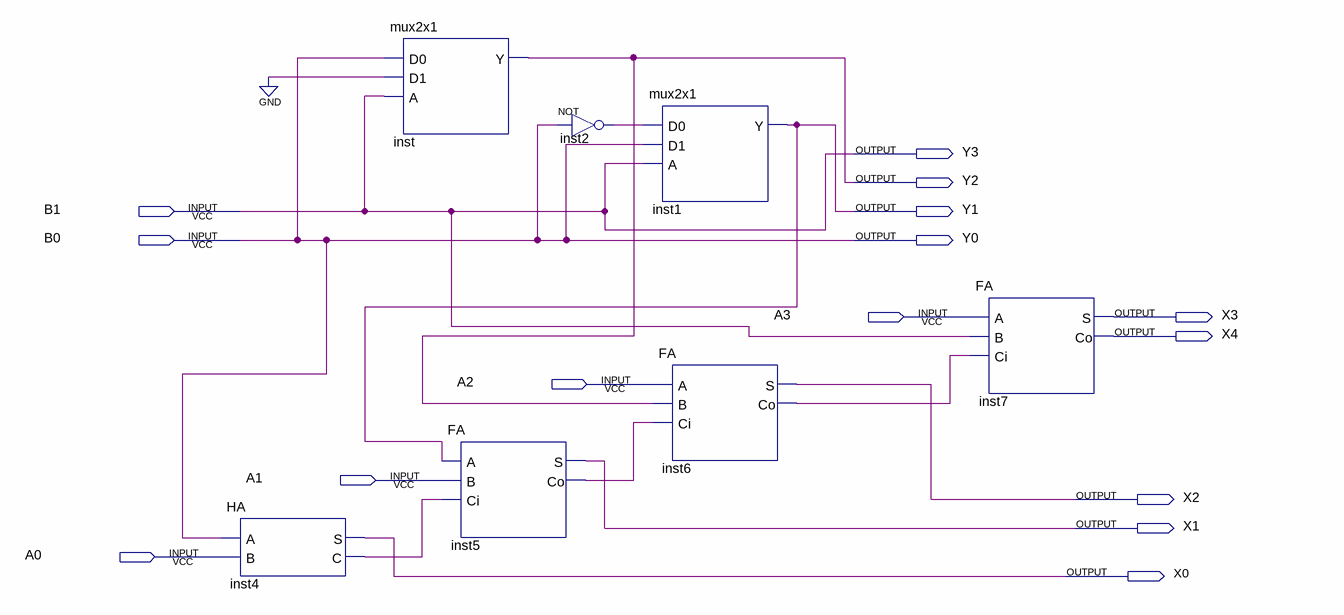
[diagram p0: schematic sheet]
// Quartus schematic Block333.bdf as structural Verilog: 7 symbols, 15 pins
module Block333 (
  input  B1,
  input  B0,
  input  A3,
  input  A2,
  input  A1,
  input  A0,
  output Y3,
  output Y2,
  output Y1,
  output Y0,
  output X3,
  output X4,
  output X2,
  output X1,
  output X0
);

  wire inst2_out, inst4_c, inst5_co, inst6_co;

  HA inst4 (.A(B0), .B(A0), .S(X0), .C(inst4_c));
  mux2x1 inst (.D0(B0), .D1(1'b0), .A(B1), .Y(Y2));
  FA inst5 (.A(Y1), .B(A1), .Ci(inst4_c), .S(X1), .Co(inst5_co));
  not inst2 (inst2_out, B0);
  mux2x1 inst1 (.D0(inst2_out), .D1(B0), .A(B1), .Y(Y1));
  FA inst6 (.A(A2), .B(Y2), .Ci(inst5_co), .S(X2), .Co(inst6_co));
  FA inst7 (.A(A3), .B(B1), .Ci(inst6_co), .S(X3), .Co(X4));

  assign Y0 = B0;
  assign Y3 = B1;
endmodule
